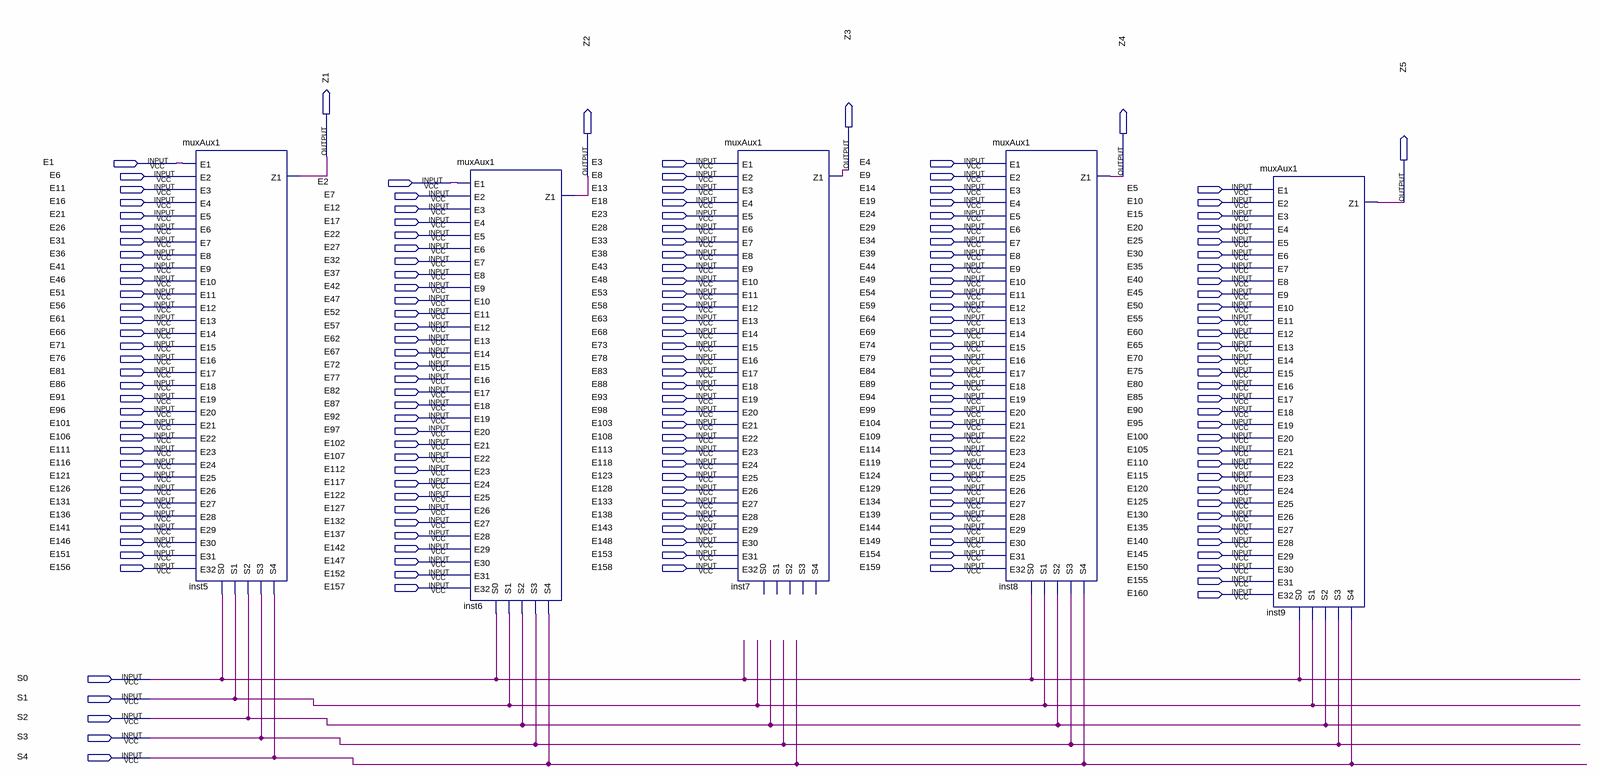
[diagram p0: schematic sheet]
// Quartus schematic Mux32x1.bdf as structural Verilog: 5 symbols, 170 pins
module Mux32x1 (
  input  E1,
  input  E3,
  input  E4,
  input  E6,
  input  E8,
  input  E9,
  input  E2,
  input  E11,
  input  E13,
  input  E14,
  input  E5,
  input  E7,
  input  E16,
  input  E18,
  input  E19,
  input  E10,
  input  E12,
  input  E21,
  input  E23,
  input  E24,
  input  E15,
  input  E17,
  input  E26,
  input  E28,
  input  E29,
  input  E20,
  input  E22,
  input  E31,
  input  E33,
  input  E34,
  input  E25,
  input  E27,
  input  E36,
  input  E38,
  input  E39,
  input  E30,
  input  E32,
  input  E41,
  input  E43,
  input  E44,
  input  E35,
  input  E37,
  input  E46,
  input  E48,
  input  E49,
  input  E40,
  input  E42,
  input  E51,
  input  E53,
  input  E54,
  input  E45,
  input  E47,
  input  E56,
  input  E58,
  input  E59,
  input  E50,
  input  E52,
  input  E61,
  input  E63,
  input  E64,
  input  E55,
  input  E57,
  input  E66,
  input  E68,
  input  E69,
  input  E60,
  input  E62,
  input  E71,
  input  E73,
  input  E74,
  input  E65,
  input  E67,
  input  E76,
  input  E78,
  input  E79,
  input  E70,
  input  E72,
  input  E81,
  input  E83,
  input  E84,
  input  E75,
  input  E77,
  input  E86,
  input  E88,
  input  E89,
  input  E80,
  input  E82,
  input  E91,
  input  E93,
  input  E94,
  input  E85,
  input  E87,
  input  E96,
  input  E98,
  input  E99,
  input  E90,
  input  E92,
  input  E101,
  input  E103,
  input  E104,
  input  E95,
  input  E97,
  input  E106,
  input  E108,
  input  E109,
  input  E100,
  input  E102,
  input  E111,
  input  E113,
  input  E114,
  input  E105,
  input  E107,
  input  E116,
  input  E118,
  input  E119,
  input  E110,
  input  E112,
  input  E121,
  input  E123,
  input  E124,
  input  E115,
  input  E117,
  input  E126,
  input  E128,
  input  E129,
  input  E120,
  input  E122,
  input  E131,
  input  E133,
  input  E134,
  input  E125,
  input  E127,
  input  E136,
  input  E138,
  input  E139,
  input  E130,
  input  E132,
  input  E141,
  input  E143,
  input  E144,
  input  E135,
  input  E137,
  input  E146,
  input  E148,
  input  E149,
  input  E140,
  input  E142,
  input  E151,
  input  E153,
  input  E154,
  input  E145,
  input  E147,
  input  E156,
  input  E158,
  input  E159,
  input  E150,
  input  E152,
  input  E155,
  input  E157,
  input  E160,
  input  S0,
  input  S1,
  input  S2,
  input  S3,
  input  S4,
  output Z1,
  output Z3,
  output Z2,
  output Z4,
  output Z5
);

  muxAux1 inst5 (
    .S0(S0), .S1(S1), .S2(S2), .S3(S3), .S4(S4), .E1(E1), .E2(E6), .E3(E11), .E4(E16), .E5(E21), .E6(E26),
    .E7(E31), .E8(E36), .E9(E41), .E10(E46), .E11(E51), .E12(E56), .E13(E61), .E14(E66), .E15(E71),
    .E16(E76), .E17(E81), .E18(E86), .E19(E91), .E20(E96), .E21(E101), .E22(E106), .E23(E111), .E24(E116),
    .E25(E121), .E26(E126), .E27(E131), .E28(E136), .E29(E141), .E30(E146), .E31(E151), .E32(E156), .Z1(Z1));
  muxAux1 inst6 (
    .S0(S0), .S1(S1), .S2(S2), .S3(S3), .S4(S4), .E1(E2), .E2(E7), .E3(E12), .E4(E17), .E5(E22), .E6(E27),
    .E7(E32), .E8(E37), .E9(E42), .E10(E47), .E11(E52), .E12(E57), .E13(E62), .E14(E67), .E15(E72),
    .E16(E77), .E17(E82), .E18(E87), .E19(E92), .E20(E97), .E21(E102), .E22(E107), .E23(E112), .E24(E117),
    .E25(E122), .E26(E127), .E27(E132), .E28(E137), .E29(E142), .E30(E147), .E31(E152), .E32(E157), .Z1(Z2));
  muxAux1 inst7 (
    .E1(E3), .E2(E8), .E3(E13), .E4(E18), .E5(E23), .E6(E28), .E7(E33), .E8(E38), .E9(E43), .E10(E48),
    .E11(E53), .E12(E58), .E13(E63), .E14(E68), .E15(E73), .E16(E78), .E17(E83), .E18(E88), .E19(E93),
    .E20(E98), .E21(E103), .E22(E108), .E23(E113), .E24(E118), .E25(E123), .E26(E128), .E27(E133),
    .E28(E138), .E29(E143), .E30(E148), .E31(E153), .E32(E158), .Z1(Z3));  // open: S0, S1, S2, S3, S4
  muxAux1 inst8 (
    .S0(S0), .S1(S1), .S2(S2), .S3(S3), .S4(S4), .E1(E4), .E2(E9), .E3(E14), .E4(E19), .E5(E24), .E6(E29),
    .E7(E34), .E8(E39), .E9(E44), .E10(E49), .E11(E54), .E12(E59), .E13(E64), .E14(E69), .E15(E74),
    .E16(E79), .E17(E84), .E18(E89), .E19(E94), .E20(E99), .E21(E104), .E22(E109), .E23(E114), .E24(E119),
    .E25(E124), .E26(E129), .E27(E134), .E28(E139), .E29(E144), .E30(E149), .E31(E154), .E32(E159), .Z1(Z4));
  muxAux1 inst9 (
    .S0(S0), .S1(S1), .S2(S2), .S3(S3), .S4(S4), .E1(E5), .E2(E10), .E3(E15), .E4(E20), .E5(E25), .E6(E30),
    .E7(E35), .E8(E40), .E9(E45), .E10(E50), .E11(E55), .E12(E60), .E13(E65), .E14(E70), .E15(E75),
    .E16(E80), .E17(E85), .E18(E90), .E19(E95), .E20(E100), .E21(E105), .E22(E110), .E23(E115), .E24(E120),
    .E25(E125), .E26(E130), .E27(E135), .E28(E140), .E29(E145), .E30(E150), .E31(E155), .E32(E160), .Z1(Z5));
endmodule
